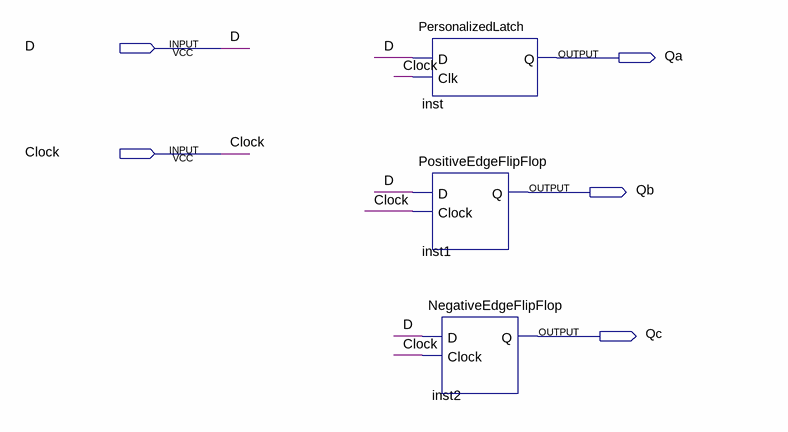
[diagram p0: schematic sheet]
// Quartus schematic part4.bdf as structural Verilog: 3 symbols, 5 pins
module part4 (
  input  D,
  input  Clock,
  output Qa,
  output Qb,
  output Qc
);

  PersonalizedLatch inst (.D(D), .Clk(Clock), .Q(Qa));
  PositiveEdgeFlipFlop inst1 (.D(D), .Clock(Clock), .Q(Qb));
  NegativeEdgeFlipFlop inst2 (.D(D), .Clock(Clock), .Q(Qc));
endmodule
